# EAGLE design Soldeertin_dispenser (EAGLE 9.6.2)
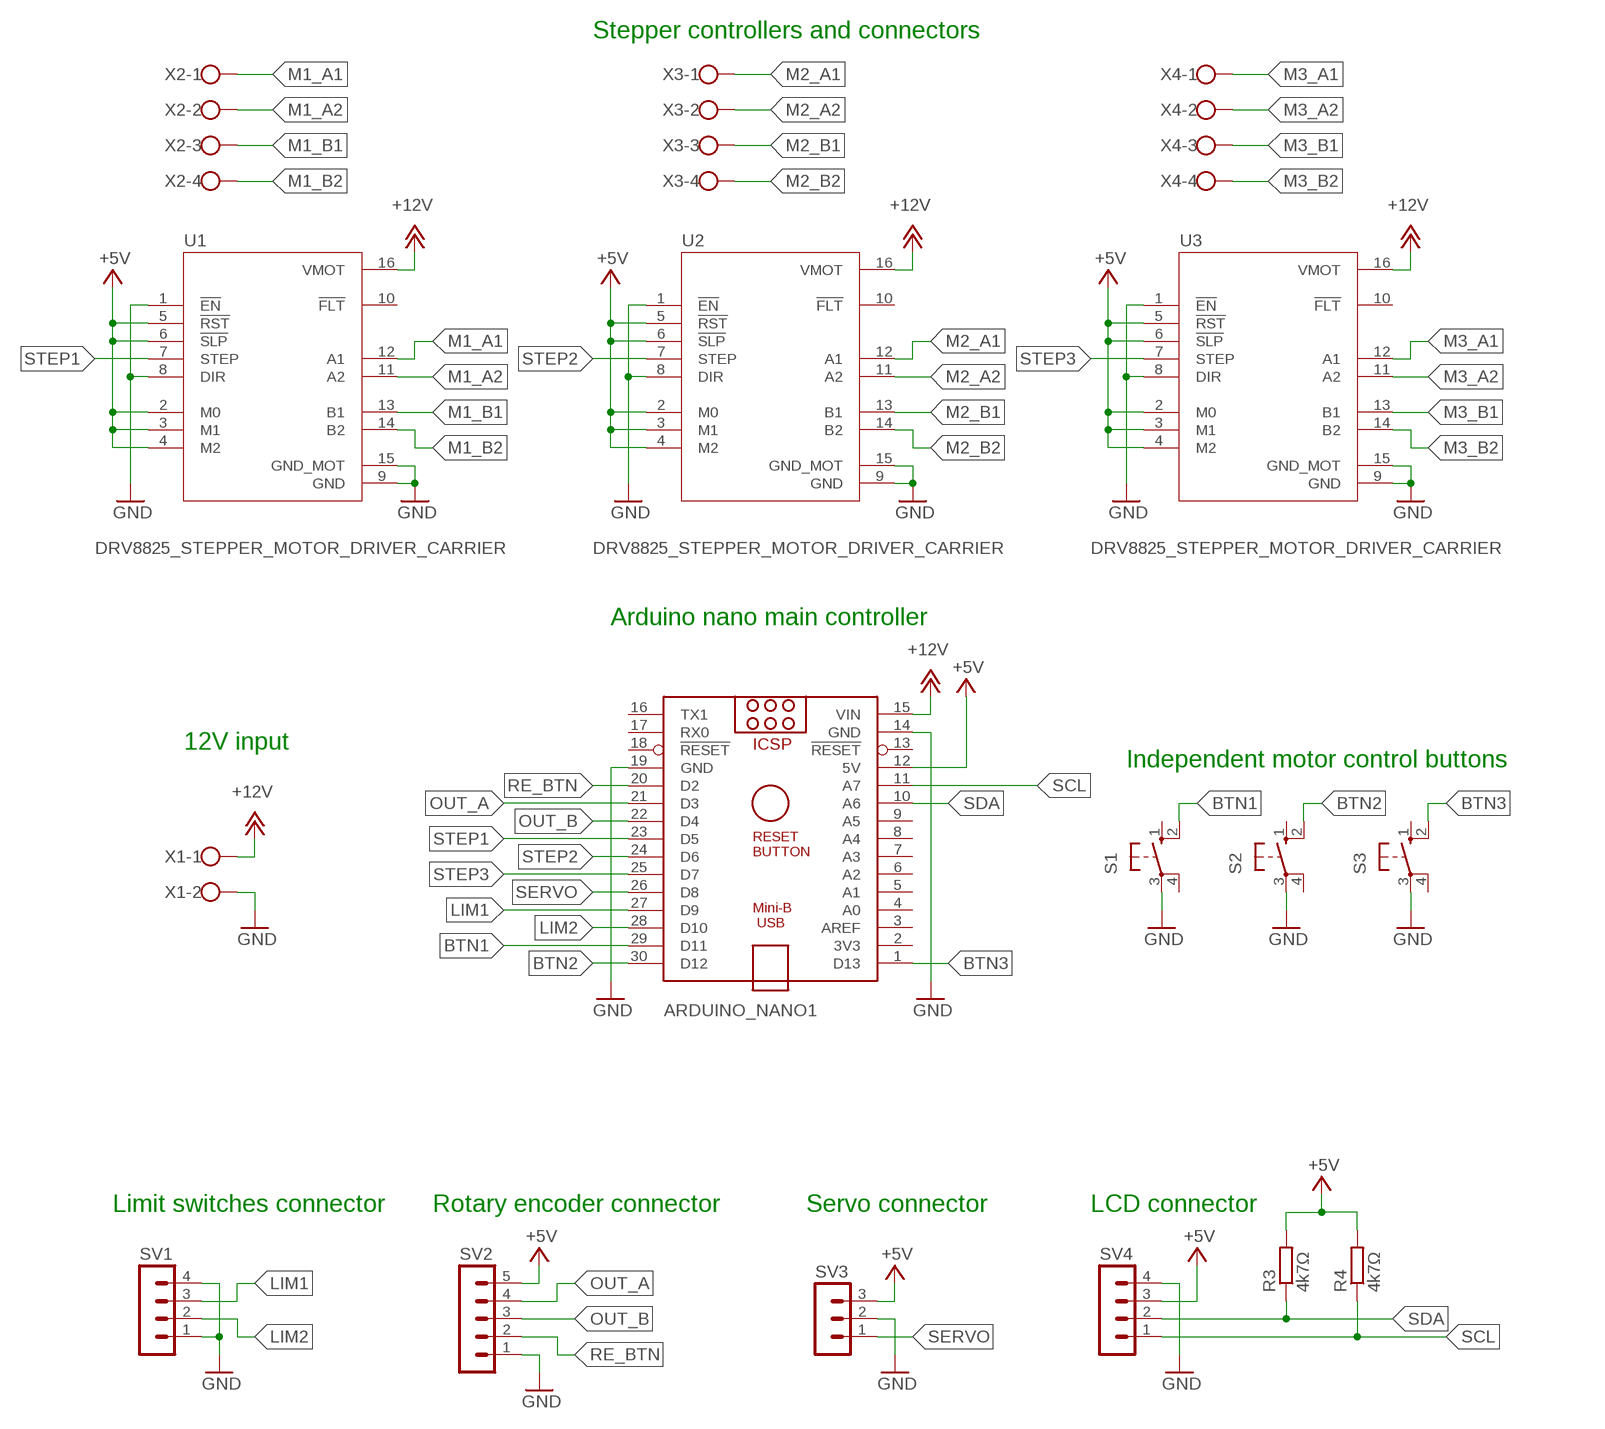
[diagram p0: schematic, sheet 1]

## Parts
ARDUINO_NANO1  ARDUINO_NANO  [ARDUINO_NANO]
R3  4k7Ω  R-EU_0207/10  [0207/10]
R4  4k7Ω  R-EU_0207/10  [0207/10]
S1  10-XX  [B3F-10XX]
S2  10-XX  [B3F-10XX]
S3  10-XX  [B3F-10XX]
SV1  MA04-1  [MA04-1]
SV2  MA05-1  [MA05-1]
SV3  MA03-1  [MA03-1]
SV4  MA04-1  [MA04-1]
U1  DRV8825_STEPPER_MOTOR_DRIVER_CARRIER  [IC_DRV8825_STEPPER_MOTOR_DRIVER_CARRIER]
U2  DRV8825_STEPPER_MOTOR_DRIVER_CARRIER  [IC_DRV8825_STEPPER_MOTOR_DRIVER_CARRIER]
U3  DRV8825_STEPPER_MOTOR_DRIVER_CARRIER  [IC_DRV8825_STEPPER_MOTOR_DRIVER_CARRIER]
X1  W237-102  [W237-102]
X2  W237-4  [W237-4]
X3  W237-4  [W237-4]
X4  W237-4  [W237-4]

## Nets
+5V: ARDUINO_NANO1.12(5V) R3.2 R4.2 SV2.5 SV3.3 SV4.3 U1.2(M0) U1.3(M1) U1.4(M2) U1.5(!RST) U1.6(!SLP) U2.2(M0) U2.3(M1) U2.4(M2) U2.5(!RST) U2.6(!SLP) U3.2(M0) U3.3(M1) U3.4(M2) U3.5(!RST) U3.6(!SLP)
+12V: ARDUINO_NANO1.15(VIN) U1.16(VMOT) U2.16(VMOT) U3.16(VMOT) X1.1
BTN1: ARDUINO_NANO1.29(D11) S1.2(S1)
BTN2: ARDUINO_NANO1.30(D12) S2.2(S1)
BTN3: ARDUINO_NANO1.1(D13) S3.2(S1)
GND: ARDUINO_NANO1.14(GND) ARDUINO_NANO1.19(GND) S1.3(P) S2.3(P) S3.3(P) SV1.1 SV1.4 SV2.1 SV3.2 SV4.4 U1.1(!EN) U1.8(DIR) U1.9(GND) U1.15(GND_MOT) U2.1(!EN) U2.8(DIR) U2.9(GND) U2.15(GND_MOT) U3.1(!EN) U3.8(DIR) U3.9(GND) U3.15(GND_MOT) X1.2
LIM1: ARDUINO_NANO1.27(D9) SV1.3
LIM2: ARDUINO_NANO1.28(D10) SV1.2
M1_A1: U1.12(A1) X2.1
M1_A2: U1.11(A2) X2.2
M1_B1: U1.13(B1) X2.3
M1_B2: U1.14(B2) X2.4
M2_A1: U2.12(A1) X3.1
M2_A2: U2.11(A2) X3.2
M2_B1: U2.13(B1) X3.3
M2_B2: U2.14(B2) X3.4
M3_A1: U3.12(A1) X4.1
M3_A2: U3.11(A2) X4.2
M3_B1: U3.13(B1) X4.3
M3_B2: U3.14(B2) X4.4
OUT_A: ARDUINO_NANO1.21(D3) SV2.4
OUT_B: ARDUINO_NANO1.22(D4) SV2.3
RE_BTN: ARDUINO_NANO1.20(D2) SV2.2
SCL: ARDUINO_NANO1.11(A7) R4.1 SV4.1
SDA: ARDUINO_NANO1.10(A6) R3.1 SV4.2
SERVO: ARDUINO_NANO1.26(D8) SV3.1
STEP1: ARDUINO_NANO1.23(D5) U1.7(STEP)
STEP2: ARDUINO_NANO1.24(D6) U2.7(STEP)
STEP3: ARDUINO_NANO1.25(D7) U3.7(STEP)
Unconnected: ARDUINO_NANO1.2(3V3) ARDUINO_NANO1.3(AREF) ARDUINO_NANO1.4(A0) ARDUINO_NANO1.5(A1) ARDUINO_NANO1.6(A2) ARDUINO_NANO1.7(A3) ARDUINO_NANO1.8(A4) ARDUINO_NANO1.9(A5) ARDUINO_NANO1.13(!RESET) ARDUINO_NANO1.16(TX1) ARDUINO_NANO1.17(RX0) ARDUINO_NANO1.18(!RESET) S1.1(S) S1.4(P1) S2.1(S) S2.4(P1) S3.1(S) S3.4(P1) U1.10(!FLT) U2.10(!FLT) U3.10(!FLT)

## Notes on the sheet
- Stepper controllers and connectors
- Arduino nano main controller
- 12V input
- Independent motor control buttons
- Limit switches connector | Rotary encoder connector | Servo connector | LCD connector

## Library data of the parts
ARDUINO_NANO1 = ArduinoNanoV30:ARDUINO_NANO: Arduino Nano V3.0 Overview: The Arduino Nano is a small, complete, and breadboard-friendly board based on the ATmega328 (Arduino Nano 3.x) or ATmega168 (Arduino Nano 2.x). It has more or less the same functionality of the Arduino Duemilanove, but in a different package. It lacks only a DC power jack, and works with a Mini-B USB cable instead of a standard one. The Nano was designed and is being produced by Gravitech. Specifications: Microcontroller Atmel ATmega168 or ATmega328 Operating Voltage (logic level) 5 V Input Voltage (recommended) 7-12 V Input Voltage (limits) 6-20 V Digital I/O Pins 14 (of which 6 provide PWM output) Analog Input Pins 8 DC Current per I/O Pin 40 mA Flash Memory 16 KB (ATmega168) or 32 KB (ATmega328) of which 2 KB used by bootloader SRAM 1 KB (ATmega168) or 2 KB (ATmega328) EEPROM 512 bytes (ATmega168) or 1 KB (ATmega328) Clock Speed 16 MHz Dimensions 0.73" x 1.70" Length 45 mm Width 18 mm Weigth 5 g Power: The Arduino Nano can be powered via the Mini-B USB connection, 6-20V unregulated external power supply (pin 30), or 5V regulated external power supply (pin 27). The power source is automatically selected to the highest voltage source. Memory: The ATmega168 has 16 KB of flash memory for storing code (of which 2 KB is used for the bootloader); the ATmega328 has 32 KB, (also with 2 KB used for the bootloader). The ATmega168 has 1 KB of SRAM and 512 bytes of EEPROM (which can be read and written with the EEPROM library); the ATmega328 has 2 KB of SRAM and 1 KB of EEPROM. Input and Output: Each of the 14 digital pins on the Nano can be used as an input or output, using pinMode(), digitalWrite(), and digitalRead() functions. They operate at 5 volts. Each pin can provide or receive a maximum of 40 mA and has an internal pull-up resistor (disconnected by default) of 20-50 kOhms. In addition, some pins have specialized functions. Visit Arduino - ArduinoBoardNano <https://www.arduino.cc/en/Main/ArduinoBoardNano>
R3 R4 = resistor:R-EU_: RESISTOR, European symbol; SPICEPREFIX: R
S1-S3 = switch-omron:10-XX: OMRON SWITCH; MPN: B3F-1000; OC_FARNELL: 176432; OC_NEWARK: 36M3542
SV1 SV4 = con-lstb:MA04-1: PIN HEADER; OC_FARNELL: unknown; OC_NEWARK: unknown
SV2 = con-lstb:MA05-1: PIN HEADER; OC_FARNELL: unknown; OC_NEWARK: unknown
SV3 = con-lstb:MA03-1: PIN HEADER; OC_FARNELL: unknown; OC_NEWARK: unknown
U1-U3 = DRV8825_STEPPER_MOTOR_DRIVER_CARRIER:DRV8825_STEPPER_MOTOR_DRIVER_CARRIER: Stepper motor controler; IC: DRV8825; 1.5A; Uin mot: 8.2÷45V Check availability <https://pricing.snapeda.com/parts/DRV8825%20STEPPER%20MOTOR%20DRIVER%20CARRIER/Pololu/view-part?ref=eda>; AVAILABILITY: Not in stock; DESCRIPTION: Stepper, Bipolar 8.2 ~ 45VDC Supply 1.5A 8.2 ~ 45V Load; MF: Pololu; MP: DRV8825 STEPPER MOTOR DRIVER CARRIER; PACKAGE: None; PRICE: None
X1 = con-wago-500:W237-102: WAGO SCREW CLAMP; MPN: 237-102; OC_FARNELL: unknown; OC_NEWARK: 70K9898
X2-X4 = con-wago-500:W237-4: WAGO SCREW CLAMP; OC_FARNELL: unknown; OC_NEWARK: unknown

## Board
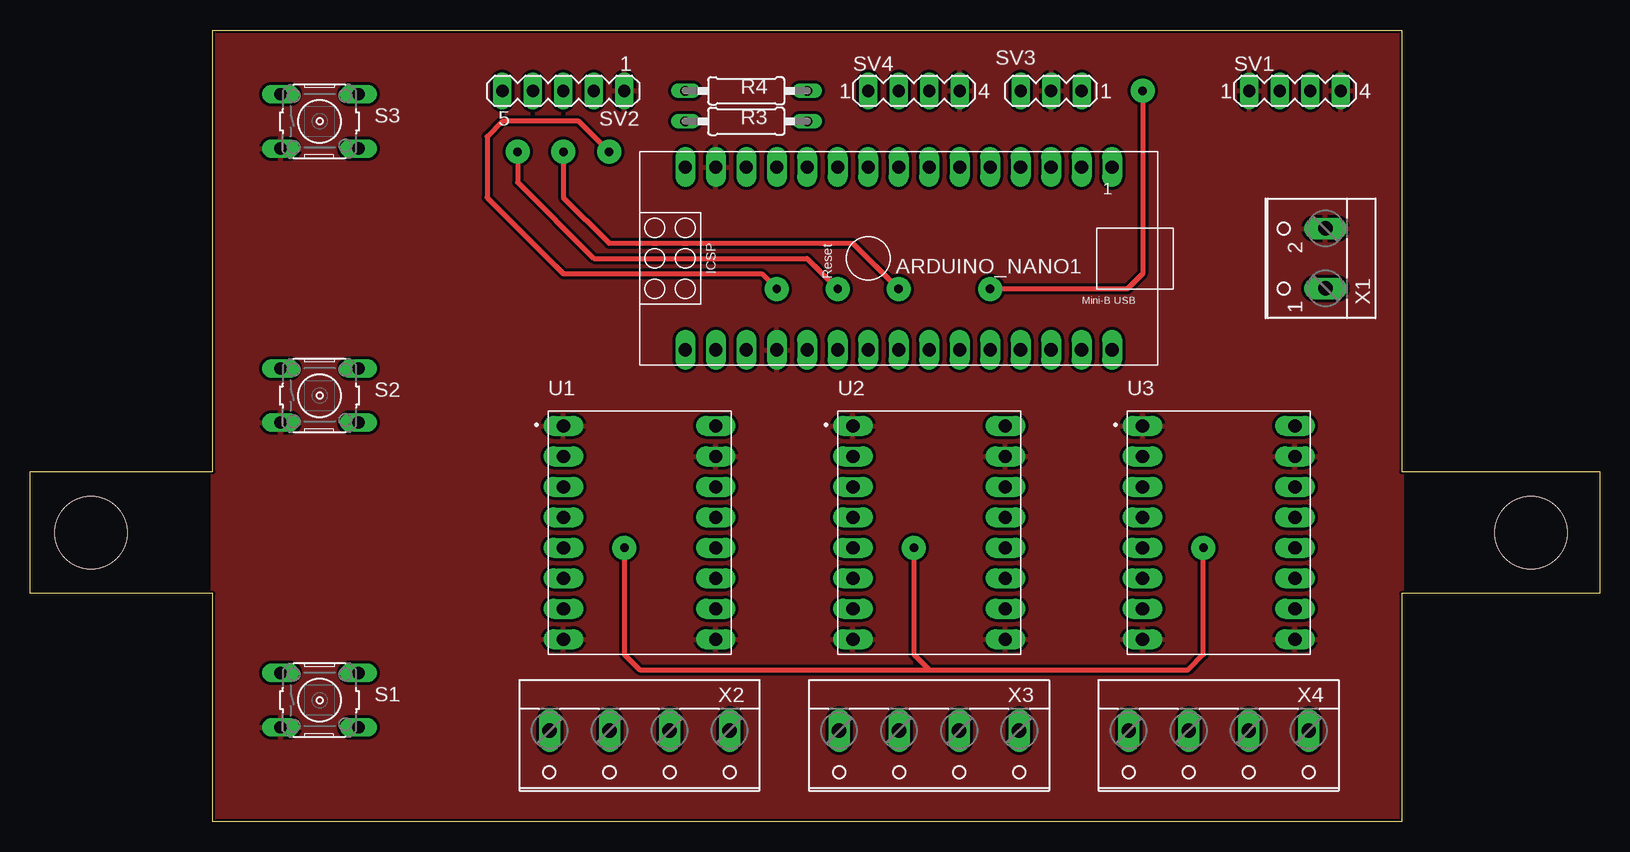
[diagram p1: board, top side]
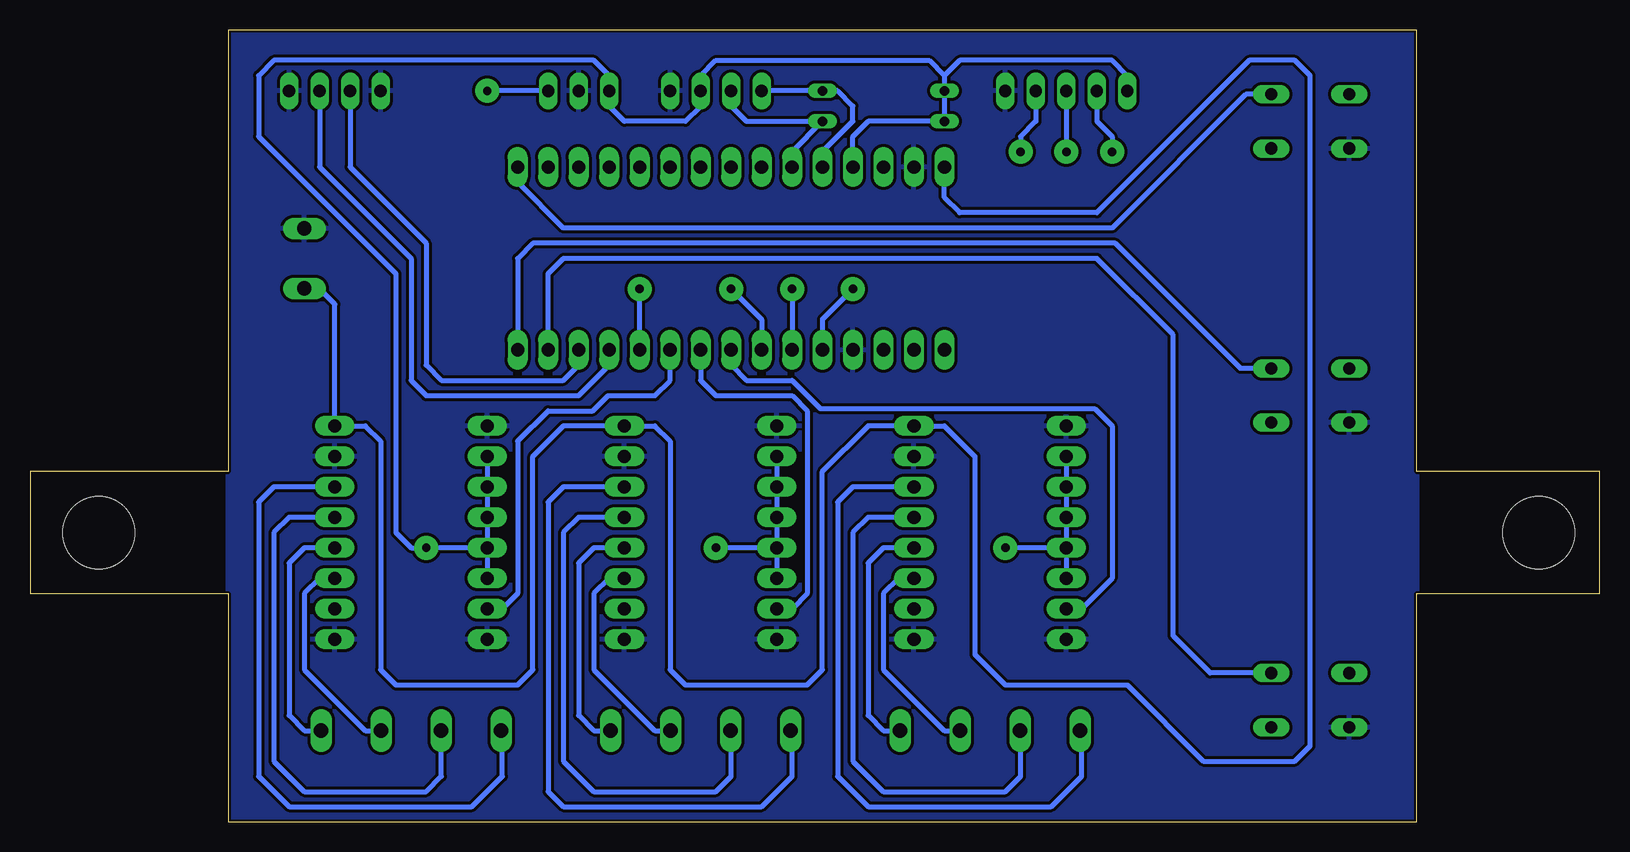
[diagram p2: board, bottom side, seen from below]

Size 130.81 x 66.04 mm. Coordinates in mm from the lower left corner, seen from the top.
Outline: 0,19.05 0,29.21 15.24,29.21 15.24,66.04 114.3,66.04 114.3,29.21 130.81,29.21 130.81,19.05 114.3,19.05 114.3,0 15.24,0 15.24,19.05 0,19.05
Copper layers (1*16): Top 0.035mm / dielectric 1.5mm / Bottom 0.035mm
Design rules "LPKF-S63_Design-Rules": minimum track width 0.2mm, minimum drill 0.35mm, track to track 0.25mm, track to pad 0.25mm, pad to pad 0.2mm, via to via 0.25mm, smd to smd 0.25mm, copper to edge 0.2mm, drill to drill 0.3mm, minimum pad ring 0.1mm, minimum via ring 0.1mm, stop-mask expansion 4mil, vias tented up to drill 0mil, thermal gap 10mil
Holes 6 mm at 5.08,24.13 125.08,24.13

### Footprints (pad centres in the part's own frame; a part is rotated, then mirrored left to right if it is on the bottom)
ARDUINO_NANO = drill 1.1 pad 1.676 long: 1 -20.32,-7.62; 2 -17.78,-7.62; 3 -15.24,-7.62; 4 -12.7,-7.62; 5 -10.16,-7.62; 6 -7.62,-7.62; 7 -5.08,-7.62; 8 -2.54,-7.62; 9 0,-7.62; 10 2.54,-7.62; 11 5.08,-7.62; 12 7.62,-7.62; 13 10.16,-7.62; 14 12.7,-7.62; 15 15.24,-7.62; 16 15.24,7.62; 17 12.7,7.62; 18 10.16,7.62; 19 7.62,7.62; 20 5.08,7.62; 21 2.54,7.62; 22 0,7.62; 23 -2.54,7.62; 24 -5.08,7.62; 25 -7.62,7.62; 26 -10.16,7.62; 27 -12.7,7.62; 28 -15.24,7.62; 29 -17.78,7.62; 30 -20.32,7.62
0207/10 = drill 0.813 long: 1 -5.08,0; 2 5.08,0
B3F-10XX = drill 1.016 long: 1 -3.251,2.261; 2 3.251,2.261; 3 -3.251,-2.261; 4 3.251,-2.261
MA04-1 = drill 1.016 long: 1 -3.81,0; 2 -1.27,0; 3 1.27,0; 4 3.81,0
MA05-1 = drill 1.016 long: 1 -5.08,0; 2 -2.54,0; 3 0,0; 4 2.54,0; 5 5.08,0
MA03-1 = drill 1.016 long: 1 -2.54,0; 2 0,0; 3 2.54,0
IC_DRV8825_STEPPER_MOTOR_DRIVER_CARRIER = drill 1.1 long: 1 -6.35,8.89; 2 -6.35,6.35; 3 -6.35,3.81; 4 -6.35,1.27; 5 -6.35,-1.27; 6 -6.35,-3.81; 7 -6.35,-6.35; 8 -6.35,-8.89; 9 6.35,-8.89; 10 6.35,-6.35; 11 6.35,-3.81; 12 6.35,-1.27; 13 6.35,1.27; 14 6.35,3.81; 15 6.35,6.35; 16 6.35,8.89
W237-102 = drill 1.194 long: 1 -2.5,-1.27; 2 2.5,-1.27
W237-4 = drill 1.194 long: 1 -7.5,-1.27; 2 -2.5,-1.27; 3 2.5,-1.27; 4 7.5,-1.27

### Placement (x,y rotation side)
ARDUINO_NANO1  69.85,46.99 180 top
R3  59.69,58.42 180 top
R4  59.69,60.96 180 top
S1  24.13,10.16 0 top
S2  24.13,35.56 0 top
S3  24.13,58.42 0 top
SV1  105.41,60.96 0 top
SV2  44.45,60.96 180 top
SV3  85.09,60.96 180 top
SV4  73.66,60.96 0 top
U1  50.8,24.13 0 top
U2  74.93,24.13 0 top
U3  99.06,24.13 0 top
X1  106.68,46.99 90 top
X2  50.8,6.35 180 top
X3  74.93,6.35 180 top
X4  99.06,6.35 180 top

### Tracks (layer width: path | path; a pad name or v marks a point on that pad's centre or on a via)
+5V  (via drill 0.7 pad 2)
  Top 0.406: v49.53,22.86 49.53,13.97 50.8,12.7 74.93,12.7 | v97.79,22.86 97.79,13.97 96.52,12.7 74.93,12.7 | v73.66,22.86 73.66,13.97 74.93,12.7
  Bottom 0.406: U2.5 U2.6 | U1.5 U1.6 | U3.5 U3.6 | 54.61,62.23 55.88,63.5 73.66,63.5 74.93,62.23 SV4.3 74.93,59.69 76.2,58.42 81.28,58.42 82.55,59.69 SV3.3 82.55,62.23 83.82,63.5 110.49,63.5 111.76,62.23 111.76,57.15 100.33,45.72 100.33,24.13 99.06,22.86 v97.79,22.86 U3.5 | 54.61,62.23 R4.2 R3.2 60.96,58.42 62.23,57.15 ARDUINO_NANO1.12 | SV2.5 39.37,62.23 40.64,63.5 53.34,63.5 54.61,62.23 | U2.5 v73.66,22.86 | U1.5 v49.53,22.86 | U1.2 U1.3 U1.4 U1.5 | U2.2 U2.3 U2.4 U2.5 | U3.2 U3.3 U3.4 U3.5
+12V
  Bottom 0.406: 107.91,44.49 X1.1 106.72,44.49 105.41,43.18 U3.16 102.87,33.02 101.6,31.75 101.6,12.7 100.33,11.43 90.17,11.43 88.9,12.7 88.9,30.48 86.36,33.02 U2.16 78.74,33.02 77.47,31.75 77.47,12.7 76.2,11.43 66.04,11.43 64.77,12.7 64.77,29.21 60.96,33.02 U1.16 54.61,33.02 52.07,30.48 52.07,13.97 49.53,11.43 39.37,11.43 33.02,5.08 25.4,5.08 24.13,6.35 24.13,62.23 25.4,63.5 29.21,63.5 41.91,50.8 53.34,50.8 54.61,52.07 ARDUINO_NANO1.15
BTN1
  Bottom 0.406: S1.2 32.46,12.42 35.56,15.52 35.56,40.64 41.91,46.99 86.36,46.99 87.63,45.72 ARDUINO_NANO1.29
BTN2
  Bottom 0.406: S2.2 29.92,37.82 40.36,48.26 88.9,48.26 90.17,46.99 ARDUINO_NANO1.30
BTN3
  Bottom 0.406: S3.2 29.49,60.68 40.64,49.53 86.36,49.53 90.17,53.34 ARDUINO_NANO1.1
GND
  Bottom 0.406: 107.99,49.53 X1.2 107.95,49.53
  pour Bottom: 15.24,66.04 15.24,0 114.3,0 114.3,66.04
  pour Top: 15.24,66.04 15.24,0 114.3,0 114.3,66.04
LIM1
  Bottom 0.406: SV1.3 106.68,54.61 99.06,46.99 99.06,36.83 97.79,35.56 85.09,35.56 82.55,38.1 ARDUINO_NANO1.27
LIM2
  Bottom 0.406: SV1.2 104.14,54.61 97.79,48.26 97.79,38.1 96.52,36.83 86.36,36.83 85.09,38.1 ARDUINO_NANO1.28
M1_A1
  Bottom 0.406: U1.12 59.69,22.86 60.96,21.59 60.96,8.89 59.69,7.62 X2.1
M1_A2
  Bottom 0.406: U1.11 58.42,20.32 59.69,19.05 59.69,12.7 54.61,7.62 X2.2
M1_B1
  Bottom 0.406: U1.13 60.96,25.4 62.23,24.13 62.23,5.08 59.69,2.54 49.53,2.54 48.26,3.81 48.26,7.58 X2.3
M1_B2
  Bottom 0.406: U1.14 62.23,27.94 63.5,26.67 63.5,3.81 60.96,1.27 45.72,1.27 43.18,3.81 43.18,7.5 X2.4
M2_A1
  Bottom 0.406: U2.12 83.82,22.86 85.09,21.59 85.09,8.89 83.82,7.62 X3.1
M2_A2
  Bottom 0.406: U2.11 82.55,20.32 83.82,19.05 83.82,12.7 78.74,7.62 X3.2
M2_B1
  Bottom 0.406: U2.13 85.09,25.4 86.36,24.13 86.36,5.08 83.82,2.54 73.66,2.54 72.39,3.81 72.39,7.58 X3.3
M2_B2
  Bottom 0.406: U2.14 86.36,27.94 87.63,26.67 87.63,2.54 86.36,1.27 69.85,1.27 67.31,3.81 67.31,7.5 X3.4
M3_A1
  Bottom 0.406: U3.12 107.95,22.86 109.22,21.59 109.22,8.89 107.95,7.62 X4.1
M3_A2
  Bottom 0.406: U3.11 106.68,20.32 107.95,19.05 107.95,12.7 102.87,7.62 X4.2
M3_B1
  Bottom 0.406: U3.13 109.22,25.4 110.49,24.13 110.49,5.08 107.95,2.54 97.79,2.54 96.52,3.81 96.52,7.58 X4.3
M3_B2
  Bottom 0.406: U3.14 110.49,27.94 111.76,26.67 111.76,3.81 109.22,1.27 93.98,1.27 91.44,3.81 91.44,7.5 X4.4
OUT_A  (via drill 0.7 pad 2)
  Top 0.406: v40.64,55.88 40.64,53.34 46.99,46.99 64.77,46.99 v67.31,44.45
  Bottom 0.406: SV2.4 41.91,58.42 40.64,57.15 v40.64,55.88 | v67.31,44.45 ARDUINO_NANO1.21
OUT_B  (via drill 0.7 pad 2)
  Top 0.406: v44.45,55.88 44.45,52.07 48.26,48.26 68.58,48.26 v72.39,44.45
  Bottom 0.406: SV2.3 v44.45,55.88 | v72.39,44.45 69.85,41.91 ARDUINO_NANO1.22
RE_BTN  (via drill 0.7 pad 2)
  Top 0.406: v48.26,55.88 45.72,58.42 39.37,58.42 38.1,57.15 38.1,52.07 44.45,45.72 60.96,45.72 v62.23,44.45
  Bottom 0.406: SV2.2 46.99,58.42 48.26,57.15 v48.26,55.88 | ARDUINO_NANO1.20 64.77,41.91 v62.23,44.45
SCL
  Bottom 0.406: SV4.1 R4.1 63.5,60.96 62.23,59.69 62.23,58.42 64.77,55.88 ARDUINO_NANO1.11
SDA
  Bottom 0.406: SV4.2 72.39,59.69 71.12,58.42 R3.1 67.31,55.88 ARDUINO_NANO1.10
SERVO  (via drill 0.7 pad 2)
  Top 0.406: v92.71,60.96 92.71,45.72 91.44,44.45 v80.01,44.45
  Bottom 0.406: 80.01,38.1 ARDUINO_NANO1.26 v80.01,44.45 | SV3.1 v92.71,60.96
STEP1
  Bottom 0.406: U1.7 43.18,17.78 40.64,20.32 40.64,33.02 42.09,34.47 64.95,34.47 67.31,36.83 71.12,36.83 72.39,38.1 ARDUINO_NANO1.23
STEP2
  Bottom 0.406: U2.7 67.31,17.78 66.04,19.05 66.04,34.29 67.31,35.56 73.66,35.56 74.93,36.83 ARDUINO_NANO1.24
STEP3
  Bottom 0.406: U3.7 91.44,17.78 90.17,19.05 90.17,31.75 87.63,34.29 83.91,34.29 82.64,35.56 78.74,35.56 77.47,36.83 ARDUINO_NANO1.25